# EAGLE design MCUDemoBoard (EAGLE 9.6.2)
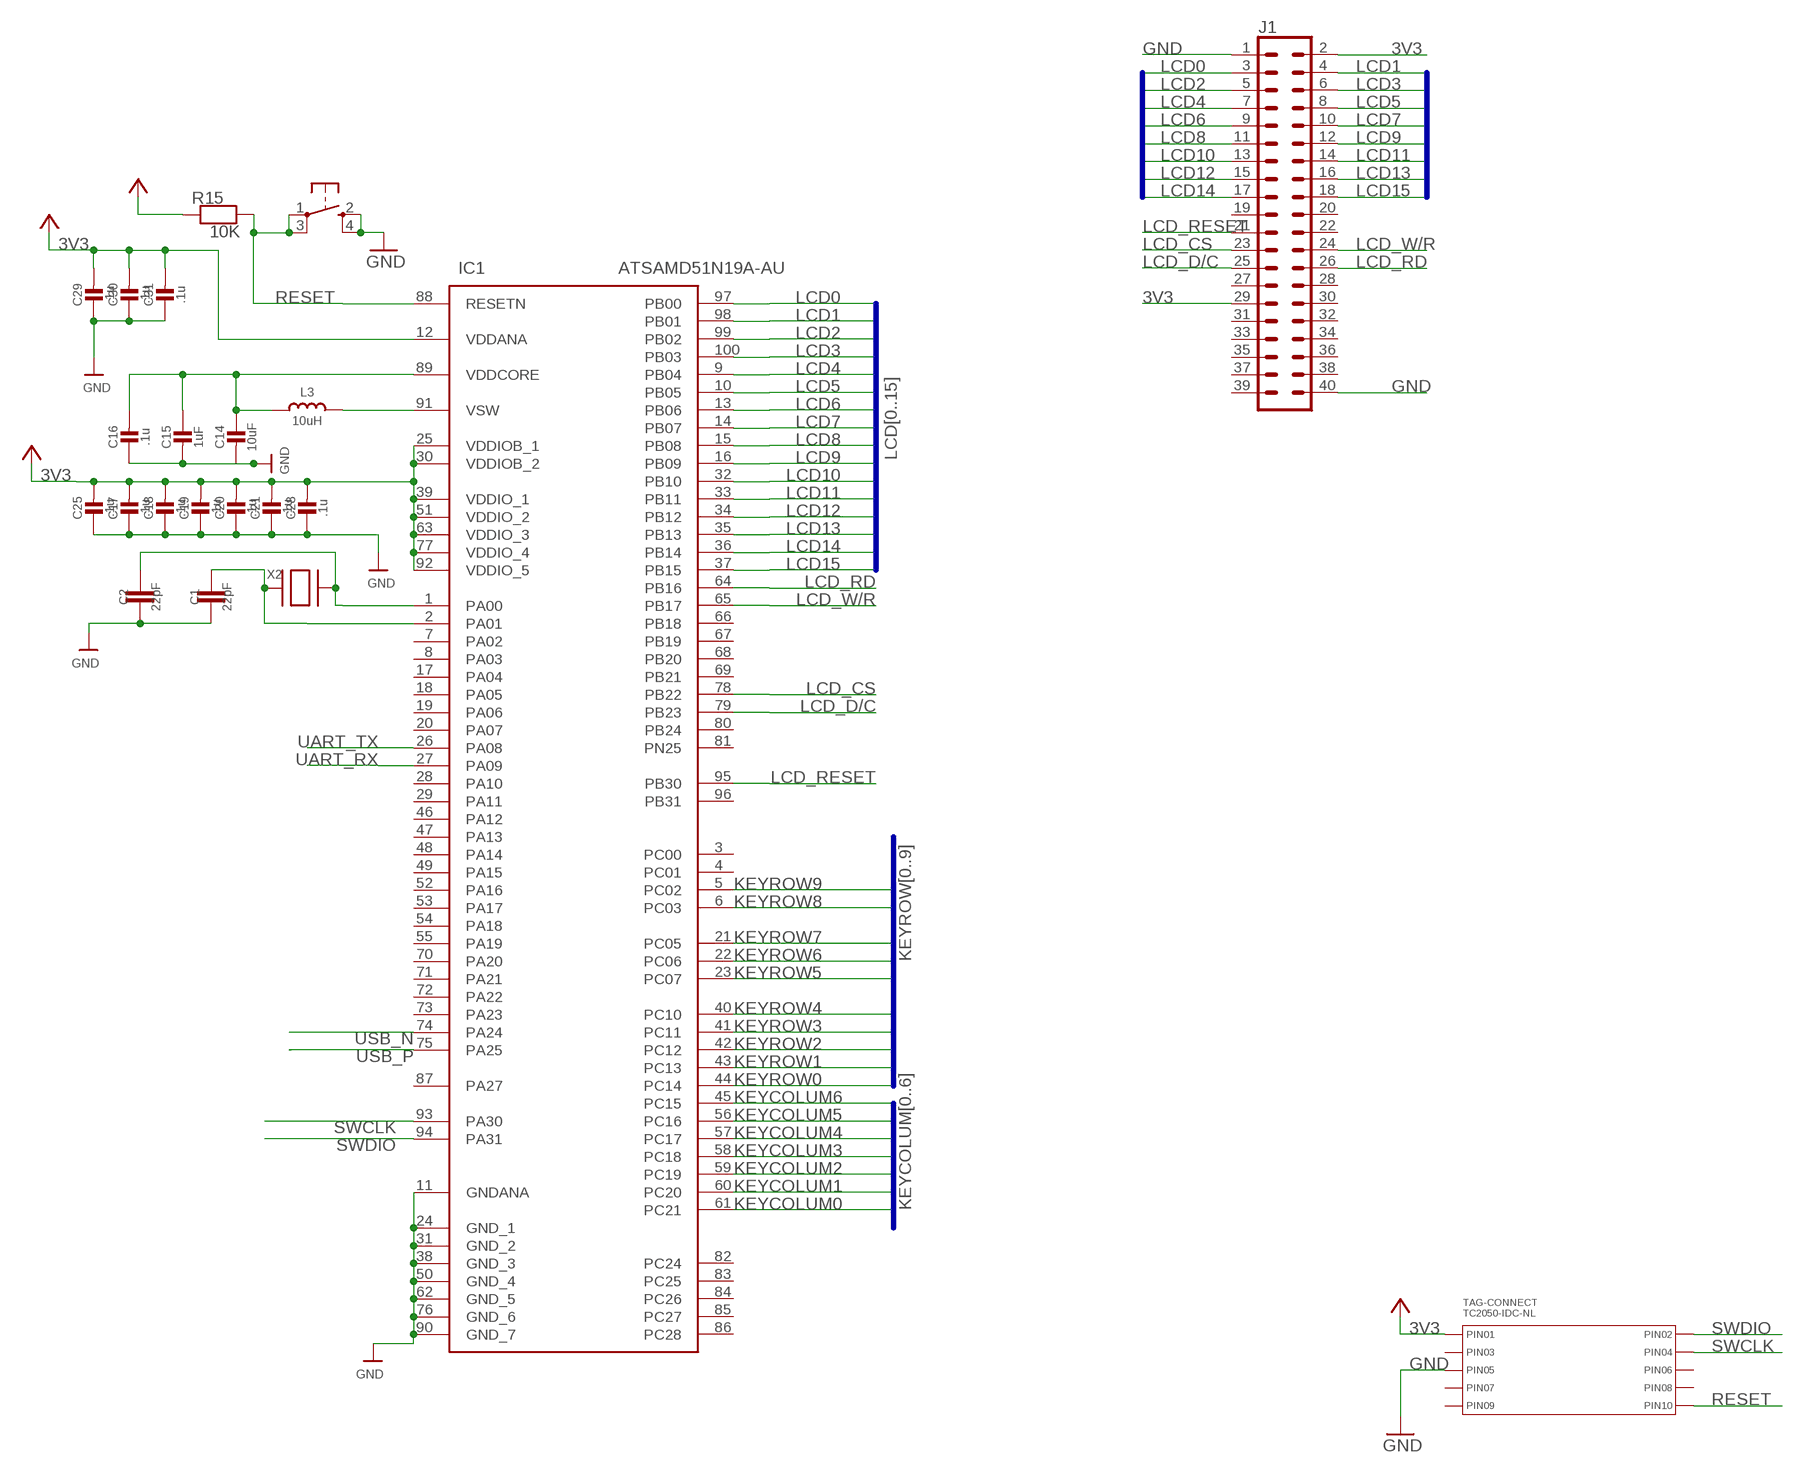
[diagram p0: schematic, sheet 1, part 1 of 2]
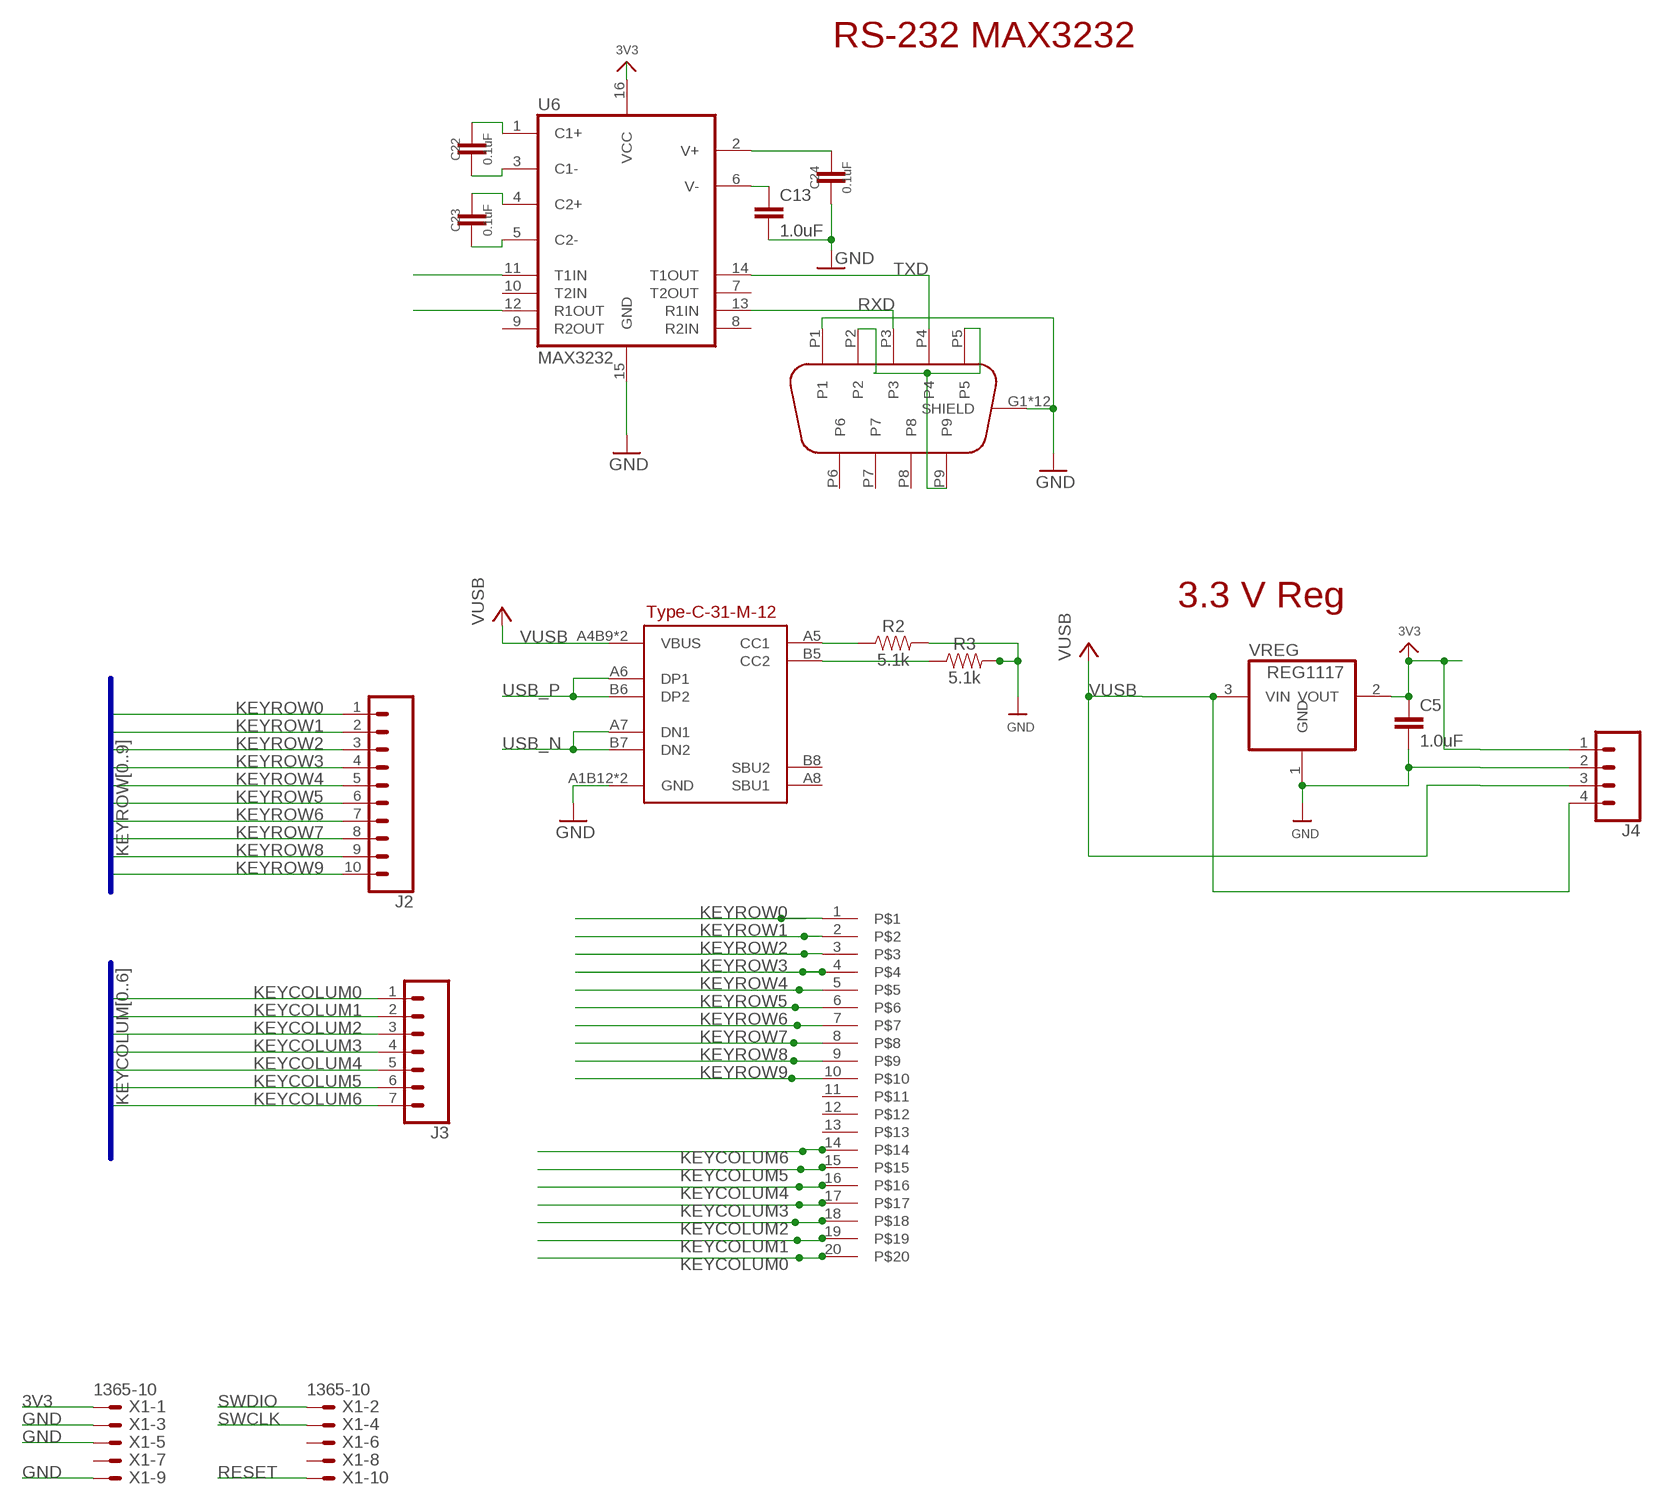
[diagram p1: schematic, sheet 1, part 2 of 2]

## Parts
C1  22pF  1.0UF-0805-25V-10%  [0805]
C2  22pF  1.0UF-0805-25V-10%  [0805]
C5  1.0uF  1.0UF-0805-25V-10%  [0805]
C13  1.0uF  1.0UF-0805-25V-10%  [0805]
C14  10uF  CAP_CERAMIC0805-NOOUTLINE  [0805-NO]
C15  1uF  CAP_CERAMIC0603_NO  [0603-NO]
C16  .1u  CAP_CERAMIC0603_NO  [0603-NO]
C17  .1u  CAP_CERAMIC0603_NO  [0603-NO]
C18  .1u  CAP_CERAMIC0603_NO  [0603-NO]
C19  .1u  CAP_CERAMIC0603_NO  [0603-NO]
C20  .1u  CAP_CERAMIC0603_NO  [0603-NO]
C21  .1u  CAP_CERAMIC0603_NO  [0603-NO]
C22  0.1uF  1.0UF-0805-25V-10%  [0805]
C23  0.1uF  1.0UF-0805-25V-10%  [0805]
C24  0.1uF  1.0UF-0805-25V-10%  [0805]
C25  .1u  CAP_CERAMIC0603_NO  [0603-NO]
C28  .1u  CAP_CERAMIC0603_NO  [0603-NO]
C29  .1u  CAP_CERAMIC0603_NO  [0603-NO]
C30  .1u  CAP_CERAMIC0603_NO  [0603-NO]
C31  .1u  CAP_CERAMIC0603_NO  [0603-NO]
DE9FEMALE  EDGEMOUNTDE9  [DE09S065TLF]
IC1  ATSAMD51N19A-AU  [QFP50P1600X1600X120-100N]
J1  CONN_20X2NOSILK  [2X20_NOSILK]
J2  CONN_10NO_SILK_PTH_FEMALE  [1X10_NO_SILK]
J3  CONN_07NO_SILK  [1X07_NO_SILK]
J4  CONN_04  [1X04]
L3  10uH  INDUCTOR  [INDUCTOR_1007]
R2  5.1k  1KOHM-0603-1/10W-1%  [0603]
R3  5.1k  1KOHM-0603-1/10W-1%  [0603]
R15  10K  RESISTOR_0603_NOOUT  [0603-NO]
SW2  SPST_TACT-KMR2  [KMR2]
TAG-CONNECT  TC2050-IDC-NL  CON_02X05_TC2050-IDC-NL  [TC2050-IDC-NL]
U6  MAX3232  MAX2323SOIC16  [SO16]
U$1  FC1-20-L2-T-WT20PIN  [FC1-20-L2-T-WT]
USB  TYPE-C-31-M-12  [TYPE-C-31-M-12]
VREG  REG1117  [SOT223]
X1  1365-10  [1365-10]
X2  NX3215SA-32.768K-STD-MUA-8  XTAL-3.2X1.5  [XTAL3215]

## Nets
3V3: C5.1 C17.2 C18.2 C19.2 C20.2 C21.2 C25.2 C28.2 C29.2 C30.2 C31.2 IC1.12(VDDANA) IC1.25(VDDIOB_1) IC1.30(VDDIOB_2) IC1.39(VDDIO_1) IC1.51(VDDIO_2) IC1.63(VDDIO_3) IC1.77(VDDIO_4) IC1.92(VDDIO_5) J1.2 J1.29 J4.1 R15.1 TAG-CONNECT.P$1(PIN1) U6.16(VCC) VREG.2(VOUT) X1.1 ; supply symbol labelled +3V3
GND: C1.1 C2.1 C5.2 C13.2 C14.2 C15.2 C16.1 C17.1 C18.1 C19.1 C20.1 C21.1 C24.2 C25.1 C28.1 C29.1 C30.1 C31.1 DE9FEMALE.G1(SHIELD) DE9FEMALE.G2(SHIELD) DE9FEMALE.G3(SHIELD) DE9FEMALE.G4(SHIELD) DE9FEMALE.G5(SHIELD) DE9FEMALE.G6(SHIELD) DE9FEMALE.G7(SHIELD) DE9FEMALE.G8(SHIELD) DE9FEMALE.G9(SHIELD) DE9FEMALE.G10(SHIELD) DE9FEMALE.G11(SHIELD) DE9FEMALE.G12(SHIELD) DE9FEMALE.P1 IC1.11(GNDANA) IC1.24(GND_1) IC1.31(GND_2) IC1.38(GND_3) IC1.50(GND_4) IC1.62(GND_5) IC1.76(GND_6) IC1.90(GND_7) J1.1 J1.40 J4.2 R2.2 R3.2 SW2.2(S) SW2.4(S1) TAG-CONNECT.P$5(PIN5) U6.15(GND) USB.A1B12(GND) USB.B1A12(GND) VREG.1(GND) X1.3 X1.5 X1.9
KEYCOLUM0: IC1.61(PC21) J3.1 U$1.20
KEYCOLUM1: IC1.60(PC20) J3.2 U$1.19
KEYCOLUM2: IC1.59(PC19) J3.3 U$1.18
KEYCOLUM3: IC1.58(PC18) J3.4 U$1.17
KEYCOLUM4: IC1.57(PC17) J3.5 U$1.16
KEYCOLUM5: IC1.56(PC16) J3.6 U$1.15
KEYCOLUM6: IC1.45(PC15) J3.7 U$1.14
KEYROW0: IC1.44(PC14) J2.1 U$1.1
KEYROW1: IC1.43(PC13) J2.2 U$1.2
KEYROW2: IC1.42(PC12) J2.3 U$1.3
KEYROW3: IC1.41(PC11) J2.4 U$1.4
KEYROW4: IC1.40(PC10) J2.5 U$1.5
KEYROW5: IC1.23(PC07) J2.6 U$1.6
KEYROW6: IC1.22(PC06) J2.7 U$1.7
KEYROW7: IC1.21(PC05) J2.8 U$1.8
KEYROW8: IC1.6(PC03) J2.9 U$1.9
KEYROW9: IC1.5(PC02) J2.10 U$1.10
LCD0: IC1.97(PB00) J1.3
LCD1: IC1.98(PB01) J1.4
LCD2: IC1.99(PB02) J1.5
LCD3: IC1.100(PB03) J1.6
LCD4: IC1.9(PB04) J1.7
LCD5: IC1.10(PB05) J1.8
LCD6: IC1.13(PB06) J1.9
LCD7: IC1.14(PB07) J1.10
LCD8: IC1.15(PB08) J1.11
LCD9: IC1.16(PB09) J1.12
LCD10: IC1.32(PB10) J1.13
LCD11: IC1.33(PB11) J1.14
LCD12: IC1.34(PB12) J1.15
LCD13: IC1.35(PB13) J1.16
LCD14: IC1.36(PB14) J1.17
LCD15: IC1.37(PB15) J1.18
LCD_CS: IC1.78(PB22) J1.23
LCD_D/C: IC1.79(PB23) J1.25
LCD_RD: IC1.64(PB16) J1.26
LCD_RESET: IC1.95(PB30) J1.21
LCD_W/R: IC1.65(PB17) J1.24
N$1: C24.1 U6.2(V+)
N$4: C2.2 IC1.1(PA00) X2.P$1
N$5: C1.2 IC1.2(PA01) X2.P$2
N$6: C22.2 U6.3(C1-)
N$9: C22.1 U6.1(C1+)
N$12: C23.1 U6.4(C2+)
N$15: C23.2 U6.5(C2-)
N$21: C13.1 U6.6(V-)
N$22: DE9FEMALE.P2 DE9FEMALE.P5 DE9FEMALE.P9
N$24: R2.1 USB.A5(CC1)
N$25: R3.1 USB.B5(CC2)
N$26: C14.1 C15.1 C16.2 IC1.89(VDDCORE) L3.P$1
N$27: IC1.91(VSW) L3.P$2
RESET: IC1.88(RESETN) R15.2 SW2.1(P) SW2.3(P1) TAG-CONNECT.P$10(PIN10) X1.10
RXD: DE9FEMALE.P3 U6.13(R1IN)
SWCLK: IC1.93(PA30) TAG-CONNECT.P$4(PIN4) X1.4
SWDIO: IC1.94(PA31) TAG-CONNECT.P$2(PIN2) X1.2
TXD: DE9FEMALE.P4 U6.14(T1OUT)
UART_RX: IC1.27(PA09) U6.12(R1OUT)
UART_TX: IC1.26(PA08) U6.11(T1IN)
USB_N: IC1.74(PA24) USB.A7(DN1) USB.B7(DN2)
USB_P: IC1.75(PA25) USB.A6(DP1) USB.B6(DP2)
VUSB: J4.3 J4.4 USB.A4B9(VBUS) USB.B4A9(VBUS) VREG.3(VIN)
Unconnected: DE9FEMALE.P6 DE9FEMALE.P7 DE9FEMALE.P8 IC1.3(PC00) IC1.4(PC01) IC1.7(PA02) IC1.8(PA03) IC1.17(PA04) IC1.18(PA05) IC1.19(PA06) IC1.20(PA07) IC1.28(PA10) IC1.29(PA11) IC1.46(PA12) IC1.47(PA13) IC1.48(PA14) IC1.49(PA15) IC1.52(PA16) IC1.53(PA17) IC1.54(PA18) IC1.55(PA19) IC1.66(PB18) IC1.67(PB19) IC1.68(PB20) IC1.69(PB21) IC1.70(PA20) IC1.71(PA21) IC1.72(PA22) IC1.73(PA23) IC1.80(PB24) IC1.81(PN25) IC1.82(PC24) IC1.83(PC25) IC1.84(PC26) IC1.85(PC27) IC1.86(PC28) IC1.87(PA27) IC1.96(PB31) J1.19 J1.20 J1.22 J1.27 J1.28 J1.30 J1.31 J1.32 J1.33 J1.34 J1.35 J1.36 J1.37 J1.38 J1.39 TAG-CONNECT.P$3(PIN3) TAG-CONNECT.P$6(PIN6) TAG-CONNECT.P$7(PIN7) TAG-CONNECT.P$8(PIN8) TAG-CONNECT.P$9(PIN9) U6.7(T2OUT) U6.8(R2IN) U6.9(R2OUT) U6.10(T2IN) U$1.11 U$1.12 U$1.13 USB.A8(SBU1) USB.B8(SBU2) X1.6 X1.7 X1.8

## Buses
LCD[0..15]
KEYCOLUM[0..6]
KEYROW[0..9]

## Notes on the sheet
- RS-232 MAX3232
- 3.3 V Reg
- Type-C-31-M-12

## Library data of the parts
C1 C2 C22-C24 = SparkFun-Capacitors:1.0UF: 1µF ceramic capacitors A capacitor is a passive two-terminal electrical component used to store electrical energy temporarily in an electric field.; PROD_ID: CAP-08064; VALUE: 1.0uF
C5 C13 = SparkFun-Capacitors:1.0UF: 1µF ceramic capacitors A capacitor is a passive two-terminal electrical component used to store electrical energy temporarily in an electric field.; PROD_ID: CAP-08064
C14-C21 C25 C28-C31 = microbuilder:CAP_CERAMIC: Ceramic Capacitors For new designs, use the packages preceded by an '_' character since they are more reliable: The following footprints should be used on most boards: _0402 - Standard footprint for regular board layouts _0603 - Standard footprint for regular board layouts _0805 - Standard footprint for regular board layouts _1206 - Standard footprint for regular board layouts For extremely tight-pitch boards where space is at a premium, the following 'micro-pitch' footprints can be used (smaller pads, no silkscreen outline, etc.): _0402MP - Micro-pitch footprint for very dense/compact boards _0603MP - Micro-pitch footprint for very dense/compact boards _0805MP - Micro-pitch footprint for very dense/compact boards _1206MP - Micro-pitch footprint for very dense/compact boards
DE9FEMALE = Serial:EDGEMOUNTDE9
IC1 = SamacSys_Parts:ATSAMD51N19A-AU: ARM Microcontrollers - MCU 120MHZ 512KB FLASH 1 00 TQFP PKG 85C Source: Datasheet <http://www.microchip.com/mymicrochip/filehandler.aspx?ddocname=en599585>; DESCRIPTION: ARM Microcontrollers - MCU 120MHZ 512KB FLASH 1 00 TQFP PKG 85C; HEIGHT: 1.2mm; MANUFACTURER_NAME: Microchip; MANUFACTURER_PART_NUMBER: ATSAMD51N19A-AU; MOUSER_PART_NUMBER: 556-ATSAMD51N19AAU; MOUSER_PRICE-STOCK: https://www.mouser.co.uk/ProductDetail/Microchip-Technology-Atmel/ATSAMD51N19A-AU?qs=HXFqYaX1Q2xcdk4pqJrDrA%3D%3D
J1 = SparkFun-Connectors:CONN_20X2: Multi connection point. Often used as Generic Header-pin footprint for 0.1 inch spaced/style header connections On any of the 0.1 inch spaced packages, you can populate with these: Break Away Headers - Straight <https://www.sparkfun.com/products/116> (PRT-00116) Break Away Male Headers - Right Angle <https://www.sparkfun.com/products/553> (PRT-00553) Female Headers <https://www.sparkfun.com/products/115> (PRT-00115) Break Away Headers - Machine Pin <https://www.sparkfun.com/products/117> (PRT-00117) Break Away Female Headers - Swiss Machine Pin <https://www.sparkfun.com/products/743> (PRT-00743)
J2 = SparkFun-Connectors:CONN_10: Multi connection point. Often used as Generic Header-pin footprint for 0.1 inch spaced/style header connections On any of the 0.1 inch spaced packages, you can populate with these: Break Away Headers - Straight <https://www.sparkfun.com/products/116> (PRT-00116) Break Away Male Headers - Right Angle <https://www.sparkfun.com/products/553> (PRT-00553) Female Headers <https://www.sparkfun.com/products/115> (PRT-00115) Break Away Headers - Machine Pin <https://www.sparkfun.com/products/117> (PRT-00117) Break Away Female Headers - Swiss Machine Pin <https://www.sparkfun.com/products/743> (PRT-00743) Arduino Stackable Header - 10 Pin <https://www.sparkfun.com/products/11376> (PRT-11376) For SCREWTERMINALS and SPRING TERMINALS visit here: Screw Terimnals on SparkFun.com <https://www.sparkfun.com/search/results?term=Screw+Terminals> (5mm/3.5mm/2.54mm spacing) This device is also useful as a general connection point to wire up your design to another part of your project. Our various solder wires solder well into these plated through hole pads. Hook-Up Wire - Assortment (Stranded, 22 AWG) <https://www.sparkfun.com/products/11375> (PRT-11375) Hook-Up Wire - Assortment (Solid Core, 22 AWG) <https://www.sparkfun.com/products/11367> (PRT-11367) View the entire wire category on our website here <https://www.sparkfun.com/categories/141> Special notes: Molex polarized connector foot print use with SKU : PRT-08231 with associated crimp pins and housings. 1MM SMD Version SKU: PRT-10208 NOTES ON THE VARIANTS LOCK and LOCK_LONGPADS... This footprint was designed to help hold the alignment of a through-hole component (i.e. 6-pin header) while soldering it into place. You may notice that each hole has been shifted either up or down by 0.005 of an inch from it's more standard position (which is a perfectly straight line). This slight alteration caused the pins (the squares in the middle) to touch the edges of the holes. Because they are alternating, it causes a "brace" to hold the component in place. 0.005 has proven to be the perfect amount of "off-center" position when using our standard breakaway headers. Although looks a little odd when you look at the bare footprint, once you have a header in there, the alteration is very hard to notice. Also,if you push a header all the way into place, it is covered up entirely on the bottom side.; PROD_ID: CONN-11563
J3 = SparkFun-Connectors:CONN_07: Multi connection point. Often used as Generic Header-pin footprint for 0.1 inch spaced/style header connections On any of the 0.1 inch spaced packages, you can populate with these: Break Away Headers - Straight <https://www.sparkfun.com/products/116> (PRT-00116) Break Away Male Headers - Right Angle <https://www.sparkfun.com/products/553> (PRT-00553) Female Headers <https://www.sparkfun.com/products/115> (PRT-00115) Break Away Headers - Machine Pin <https://www.sparkfun.com/products/117> (PRT-00117) Break Away Female Headers - Swiss Machine Pin <https://www.sparkfun.com/products/743> (PRT-00743) For SCREWTERMINALS and SPRING TERMINALS visit here: Screw Terimnals on SparkFun.com <https://www.sparkfun.com/search/results?term=Screw+Terminals> (5mm/3.5mm/2.54mm spacing) This device is also useful as a general connection point to wire up your design to another part of your project. Our various solder wires solder well into these plated through hole pads. Hook-Up Wire - Assortment (Stranded, 22 AWG) <https://www.sparkfun.com/products/11375> (PRT-11375) Hook-Up Wire - Assortment (Solid Core, 22 AWG) <https://www.sparkfun.com/products/11367> (PRT-11367) View the entire wire category on our website here <https://www.sparkfun.com/categories/141> Special notes: Molex polarized connector foot print use with SKU : PRT-08231 with associated crimp pins and housings. 1MM SMD Version SKU: PRT-10208 NOTES ON THE VARIANTS LOCK and LOCK_LONGPADS... This footprint was designed to help hold the alignment of a through-hole component (i.e. 6-pin header) while soldering it into place. You may notice that each hole has been shifted either up or down by 0.005 of an inch from it's more standard position (which is a perfectly straight line). This slight alteration caused the pins (the squares in the middle) to touch the edges of the holes. Because they are alternating, it causes a "brace" to hold the component in place. 0.005 has proven to be the perfect amount of "off-center" position when using our standard breakaway headers. Although looks a little odd when you look at the bare footprint, once you have a header in there, the alteration is very hard to notice. Also,if you push a header all the way into place, it is covered up entirely on the bottom side.
J4 = SparkFun-Connectors:CONN_04: Multi connection point. Often used as Generic Header-pin footprint for 0.1 inch spaced/style header connections On any of the 0.1 inch spaced packages, you can populate with these: Break Away Headers - Straight <https://www.sparkfun.com/products/116> (PRT-00116) Break Away Male Headers - Right Angle <https://www.sparkfun.com/products/553> (PRT-00553) Female Headers <https://www.sparkfun.com/products/115> (PRT-00115) Break Away Headers - Machine Pin <https://www.sparkfun.com/products/117> (PRT-00117) Break Away Female Headers - Swiss Machine Pin <https://www.sparkfun.com/products/743> (PRT-00743) For SCREWTERMINALS and SPRING TERMINALS visit here: Screw Terimnals on SparkFun.com <https://www.sparkfun.com/search/results?term=Screw+Terminals> (5mm/3.5mm/2.54mm spacing) This device is also useful as a general connection point to wire up your design to another part of your project. Our various solder wires solder well into these plated through hole pads. Hook-Up Wire - Assortment (Stranded, 22 AWG) <https://www.sparkfun.com/products/11375> (PRT-11375) Hook-Up Wire - Assortment (Solid Core, 22 AWG) <https://www.sparkfun.com/products/11367> (PRT-11367) View the entire wire category on our website here <https://www.sparkfun.com/categories/141> Special notes: Molex polarized connector foot print use with SKU : PRT-08231 with associated crimp pins and housings. 1MM SMD Version SKU: PRT-10208; PROD_ID: CONN-09696
L3 = microbuilder:INDUCTOR: Inductors 0603: 10nH Ceramic Inductor - microwire antenna/RF (Digikey: 712-1434-2-ND) 0805: 560nH Ceramic Inductor - RF (Digikey: 553-1047-1-ND) 270nH Ceramic Inductor - Q = 40@250MHz, +-5%, 1 Ohm DC Resistance (Digikey: 535-10506-2-ND) 1007 (2518 Metric) SMT: 10µH 10% 250mOhm 820mA 1007 Inductor (Digikey: 587-2189-1-ND) 22µH 10% 500mOhm 580mA 1007 Inductor (Digikey: 587-2190-1-ND) 47µH 10% 950mOhm 420mA 1007 Inductor (Digikey: 587-2191-1-ND) 47µH 5% 100mOhm 1A 1008 Inductor (Digikey: 732-1816-1-ND) 5.0x5.0mm (Taiyo Yuden NR5040 Series) 6.8µH 20% 2.3A 64mOhm Inductor (Digikey: 587-2374-2-ND) 5.0x5.0mm (TDK VLC5045 Series) 4.7µH 20% 3.3A 34mOhm Inductor (Digikey: 445-6526-1-ND) 6.8µH 20% 2.7A 46mOhm Inductor (Digikey: 445-6527-1-ND) 6.0x6.0mm (TDK VLC6045 Series) 4.7µH 20% 3.8A 27mOhm Inductor (Digikey: 445-6538-2-ND) 6.8µH 20% 3A 41mOhm Inductor (Digikey: 445-6540-1-ND) 6.2µH 30% 2.2A 45mOhm Inductor (Digikey: SRR5028-6R2YCT-ND) - Not TDK VLC6045 but footprint should match 6.0x6.0mm (TDK SLF6045 Series) 6.8uH 30% 2A 33mOhm Inductor (Digikey: 445-4572-1-ND, Mouser: 810-SLF645T6R8N2R0PF) 6.0x6.0mm (Sumida CDRH5D28 Series) 6.2uH 30% 1.8A 45mOhm Inductor (Digikey: 308-1542-1-ND) Taiyo Yuden NR3015T2R2M - 2.2uH 20% 1.5A (Digikey: 587-1648-2-ND, Mouser: 963-NR3015T2R2M) - Used with TI TPS62172 CoilCraft RFID Transponder Coil - MA5532-AE (For use with AS3935 Lightning Sensor) Taiyo Yuden NRH2412T2R2MNGH - 2.2uH 20% 1AA (Digikey: 587-3443-1-ND) - Used with TI LM3671 Vishay IHLP 1.0uH Molded Inductor - 24mOhm DCR, 5A, +/-20%, -55°C-125°C (Digikey: 541-1319-1-ND)
R2 R3 = SparkFun-Resistors:1KOHM: 1kΩ resistor A resistor is a passive two-terminal electrical component that implements electrical resistance as a circuit element. Resistors act to reduce current flow, and, at the same time, act to lower voltage levels within circuits. - Wikipedia; PROD_ID: RES-07856; VALUE: 1k
R15 = microbuilder:RESISTOR: Resistors For new designs, use the packages preceded by an '_' character since they are more reliable: The following footprints should be used on most boards: _0402 - Standard footprint for regular board layouts _0603 - Standard footprint for regular board layouts _0805 - Standard footprint for regular board layouts _1206 - Standard footprint for regular board layouts For extremely tight-pitch boards where space is at a premium, the following 'micro-pitch' footprints can be used (smaller pads, no silkscreen outline, etc.): _0402MP - Micro-pitch footprint for very dense/compact boards _0603MP - Micro-pitch footprint for very dense/compact boards _0805MP - Micro-pitch footprint for very dense/compact boards _1206MP - Micro-pitch footprint for very dense/compact boards
SW2 = adafruit:SPST_TACT: SMT 6mm switch, EVQQ2 series http://www.ladyada.net/library/eagle
TAG-CONNECT = MF_Connectors:CON_02X05: Library: MF_Connectors Description: Header Connector with 10 Positions and 02 Rows. Use the LABEL Attribute to label the pin on the schematic and PCB. You can remove the attributes on the PCB by using the SMASH function on the part and then deleting the text.; HOUSEPART: NO; MPN: TC2050-IDC-NL; POPULATE: 0; URL: http://www.tag-connect.com/Materials/TC2050-IDC-NL%20Datasheet.pdf
U6 = SparkFun-IC-Comms:MAX2323: RS232 Transceiver This part covers 232 drivers that are compatible with the MAX3232. Sipex SP3232EB Datasheet <http://cdn.sparkfun.com/datasheets/Components/General%20IC/SP3232EBCA-L.pdf> SparkFun Products SOIC component <https://www.sparkfun.com/products/589> (COM-00589 / IC-08171) Retired DIP component (COM-00316 / IC-08446) SparkFun Transceiver Breakout - MAX3232 <https://www.sparkfun.com/products/11189> (BOB-11189) SparkFun XBee Explorer Serial <https://www.sparkfun.com/products/13225> (WRL-13225); PROD_ID: IC-08171
U$1 = FPC:FC1-20-L2-T-WT20PIN
USB = USBC:TYPE-C-31-M-12
VREG = burr-brown:REG1117: 800mA and 1A Low Dropout (LDO) Positive Regulator 1.8V, 2.5V, 2.85V, 3.3V, 5V, and Adj; MPN: REG1117; OC_FARNELL: 1097566; OC_NEWARK: 14P6981
X1 = con-leotronics:1365-10: DUAL ROW STRAIGHT HEADER 1364 SERIES. 1.27mm x 1.27mm. Without Fixing Post. SMT Source: http://www.leotronics.co.uk/Conexcon/Data%20Sheets/sec.%20A/1364ing.pdf; OC_FARNELL: unknown; OC_NEWARK: unknown
X2 = adafruit2:XTAL: Low cost SMT crystals, no capacitors included http://www.ladyada.net/library/eagle

## Board
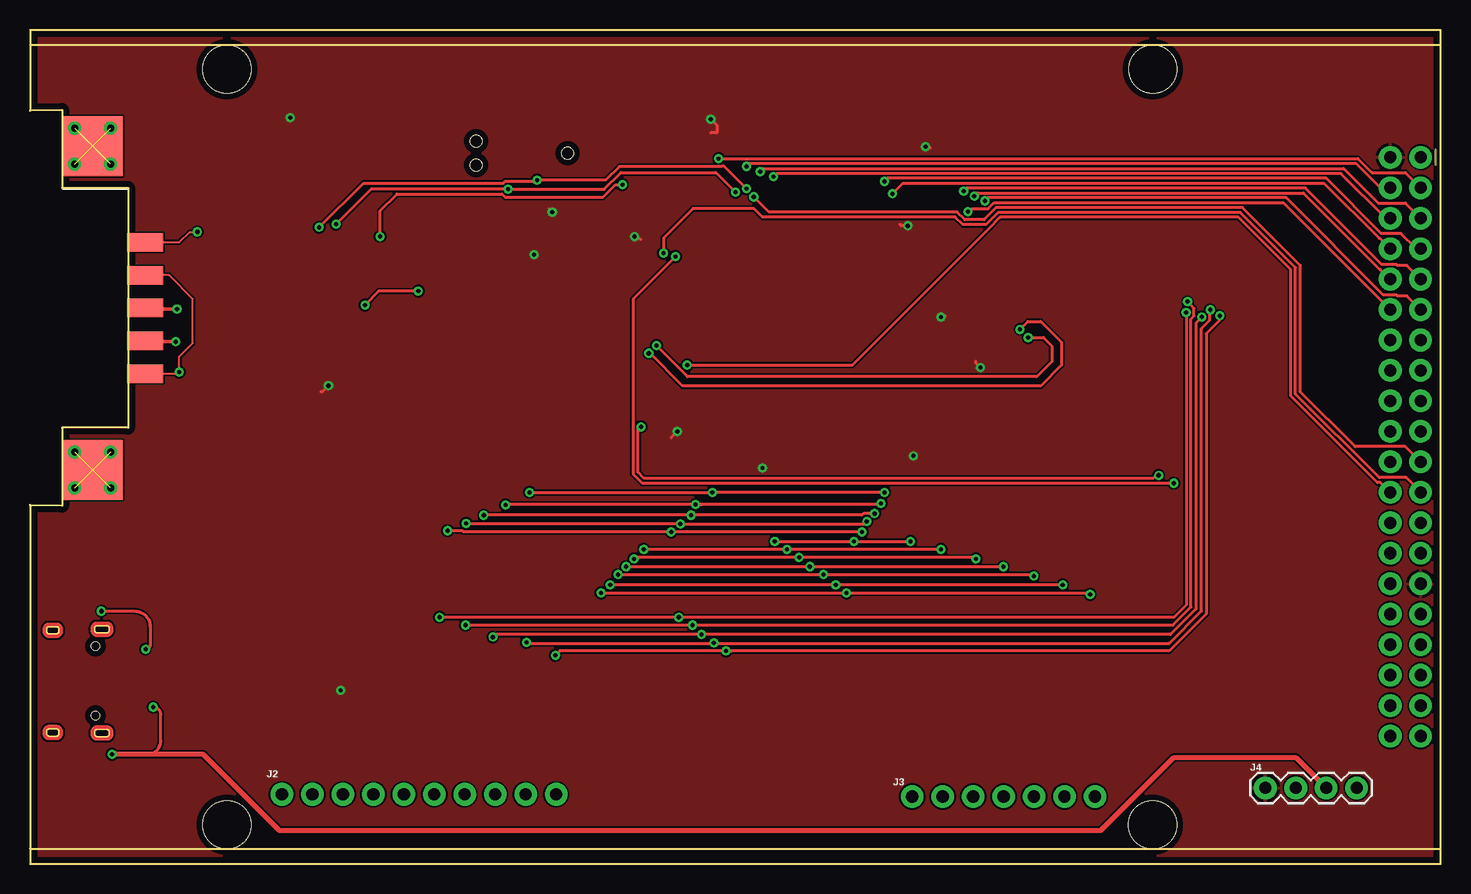
[diagram p2: board, top side]
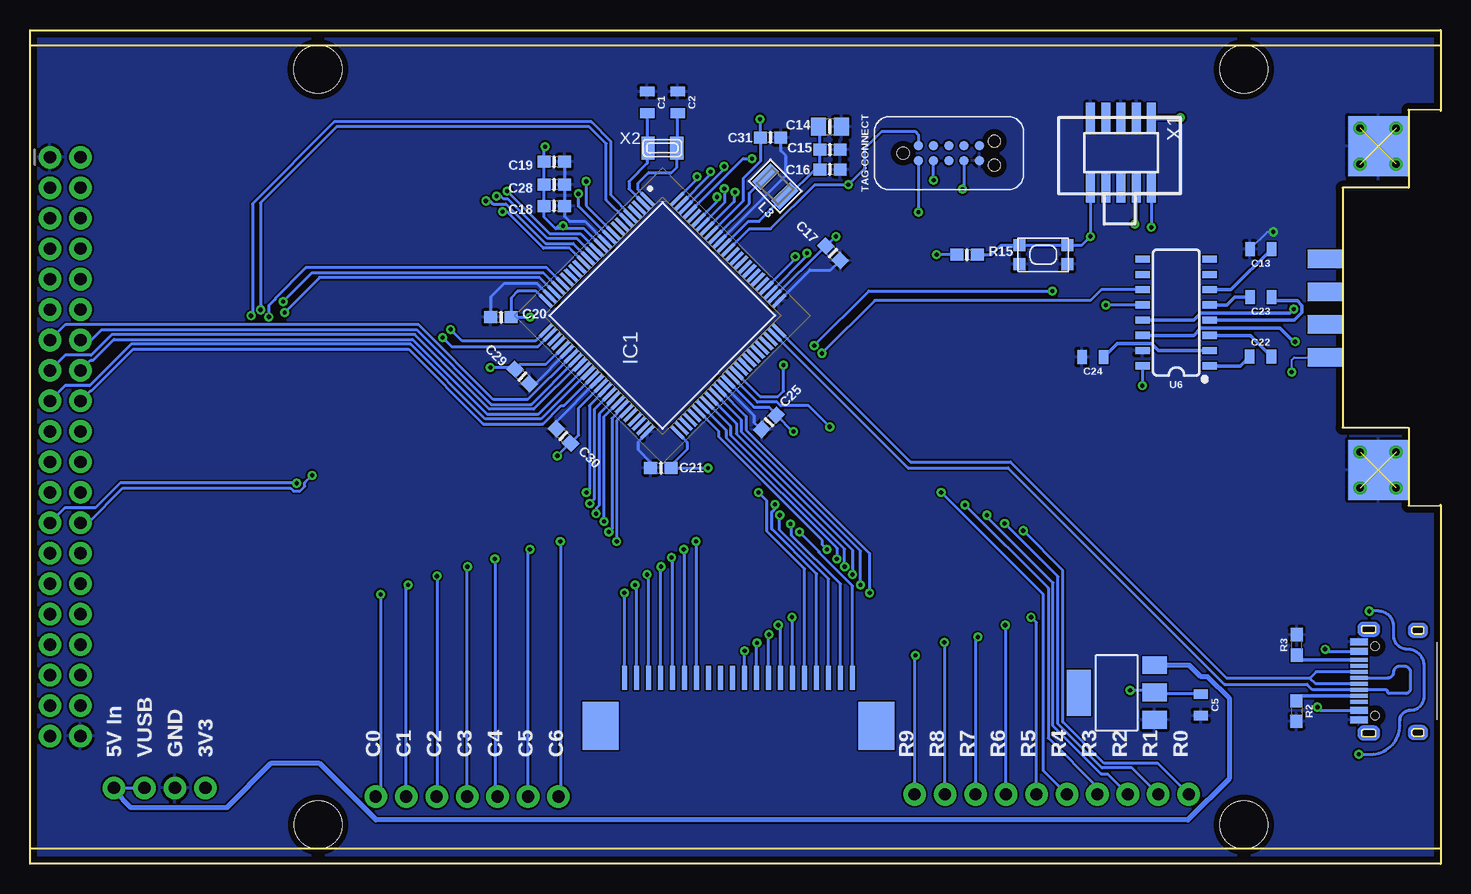
[diagram p3: board, bottom side, seen from below]

Size 117.6 x 69.54 mm. Coordinates in mm from the lower left corner, seen from the top.
Outline: 0,62.85 2.68,62.89 2.68,56.39 8.18,56.39 8.18,36.39 2.68,36.39 2.68,29.89 0,29.87
Outline: 0,62.85 0,69.54 117.6,69.54 117.6,0 0,0 0,29.87
Outline: 0,62.85 0,62.78
Outline: 0,29.95 0,29.87
Copper layers (1*16): Top 0.035mm / dielectric 1.5mm / Bottom 0.035mm
Design rules "default *": minimum track width 6mil, minimum drill 0.35mm, track to track 6mil, track to pad 6mil, pad to pad 6mil, via to via 6mil, smd to smd 6mil, copper to edge 20mil, drill to drill 6mil, minimum pad ring 10mil, minimum via ring 8mil, stop-mask expansion 4mil, vias tented up to drill 0mil, thermal gap 10mil
Holes 4 mm at 16.42,66.27 93.61,66.27 93.58,3.28 16.42,3.28
Milling: 12 lines

### Footprints (pad centres in the part's own frame; a part is rotated, then mirrored left to right if it is on the bottom)
0805 = smd 0.8 x 1.2: 1 -0.9,0; 2 0.9,0
0805-NO = smd 1.24 x 1.5: 1 -0.95,0; 2 0.95,0
0603-NO = smd 1.075 x 1: 1 -0.85,0; 2 0.85,0
DE09S065TLF = drill 0.6: G1 -15,4.5; G2 -12,4.5; G3 -15,1.5; G4 -12,1.5; G5 12,4.5; G6 15,4.5; G7 12,1.5; G8 15,1.5 | smd 5 x 5 bottom: G9 13.5,3; G10 -13.5,3 | smd 5 x 5: G11 -13.5,3; G12 13.5,3 | smd 1.54 x 3: P1 5.48,-1.37; P2 2.74,-1.37; P3 0,-1.37; P4 -2.74,-1.37; P5 -5.48,-1.37 | smd 1.54 x 3 bottom: P6 4.11,-1.37; P7 1.37,-1.37; P8 -1.37,-1.37; P9 -4.11,-1.37
QFP50P1600X1600X120-100N = smd 1.475 x 0.3: 1 -7.738,6; 2 -7.738,5.5; 3 -7.738,5; 4 -7.738,4.5; 5 -7.738,4; 6 -7.738,3.5; 7 -7.738,3; 8 -7.738,2.5; 9 -7.738,2; 10 -7.738,1.5; 11 -7.738,1; 12 -7.738,0.5; 13 -7.738,0; 14 -7.738,-0.5; 15 -7.738,-1; 16 -7.738,-1.5; 17 -7.738,-2; 18 -7.738,-2.5; 19 -7.738,-3; 20 -7.738,-3.5; 21 -7.738,-4; 22 -7.738,-4.5; 23 -7.738,-5; 24 -7.738,-5.5; 25 -7.738,-6; 51 7.738,-6; 52 7.738,-5.5; 53 7.738,-5; 54 7.738,-4.5; 55 7.738,-4; 56 7.738,-3.5; 57 7.738,-3; 58 7.738,-2.5; 59 7.738,-2; 60 7.738,-1.5; 61 7.738,-1; 62 7.738,-0.5; 63 7.738,0; 64 7.738,0.5; 65 7.738,1; 66 7.738,1.5; 67 7.738,2; 68 7.738,2.5; 69 7.738,3; 70 7.738,3.5; 71 7.738,4; 72 7.738,4.5; 73 7.738,5; 74 7.738,5.5; 75 7.738,6 | smd 0.3 x 1.475: 26 -6,-7.738; 27 -5.5,-7.738; 28 -5,-7.738; 29 -4.5,-7.738; 30 -4,-7.738; 31 -3.5,-7.738; 32 -3,-7.738; 33 -2.5,-7.738; 34 -2,-7.738; 35 -1.5,-7.738; 36 -1,-7.738; 37 -0.5,-7.738; 38 0,-7.738; 39 0.5,-7.738; 40 1,-7.738; 41 1.5,-7.738; 42 2,-7.738; 43 2.5,-7.738; 44 3,-7.738; 45 3.5,-7.738; 46 4,-7.738; 47 4.5,-7.738; 48 5,-7.738; 49 5.5,-7.738; 50 6,-7.738; 76 6,7.738; 77 5.5,7.738; 78 5,7.738; 79 4.5,7.738; 80 4,7.738; 81 3.5,7.738; 82 3,7.738; 83 2.5,7.738; 84 2,7.738; 85 1.5,7.738; 86 1,7.738; 87 0.5,7.738; 88 0,7.738; 89 -0.5,7.738; 90 -1,7.738; 91 -1.5,7.738; 92 -2,7.738; 93 -2.5,7.738; 94 -3,7.738; 95 -3.5,7.738; 96 -4,7.738; 97 -4.5,7.738; 98 -5,7.738; 99 -5.5,7.738; 100 -6,7.738
2X20_NOSILK = drill 1.016 pad 1.88: 1 0,0; 2 0,2.54; 3 2.54,0; 4 2.54,2.54; 5 5.08,0; 6 5.08,2.54; 7 7.62,0; 8 7.62,2.54; 9 10.16,0; 10 10.16,2.54; 11 12.7,0; 12 12.7,2.54; 13 15.24,0; 14 15.24,2.54; 15 17.78,0; 16 17.78,2.54; 17 20.32,0; 18 20.32,2.54; 19 22.86,0; 20 22.86,2.54; 21 25.4,0; 22 25.4,2.54; 23 27.94,0; 24 27.94,2.54; 25 30.48,0; 26 30.48,2.54; 27 33.02,0; 28 33.02,2.54; 29 35.56,0; 30 35.56,2.54; 31 38.1,0; 32 38.1,2.54; 33 40.64,0; 34 40.64,2.54; 35 43.18,0; 36 43.18,2.54; 37 45.72,0; 38 45.72,2.54; 39 48.26,0; 40 48.26,2.54
1X10_NO_SILK = drill 1.016 pad 1.88: 1 0,0; 2 2.54,0; 3 5.08,0; 4 7.62,0; 5 10.16,0; 6 12.7,0; 7 15.24,0; 8 17.78,0; 9 20.32,0; 10 22.86,0
1X07_NO_SILK = drill 1.016 pad 1.88: 1 0,0; 2 2.54,0; 3 5.08,0; 4 7.62,0; 5 10.16,0; 6 12.7,0; 7 15.24,0
1X04 = drill 1.016 pad 1.88: 1 0,0; 2 2.54,0; 3 5.08,0; 4 7.62,0
INDUCTOR_1007 = smd 1.016 x 2.2: P$1 -1.127,0; P$2 1.127,0
0603 = smd 1.1 x 1: 1 -0.85,0; 2 0.85,0
KMR2 = smd 1 x 1: 1 2,0.8; 2 2,-0.8; 3 -2,0.8; 4 -2,-0.8
TC2050-IDC-NL = smd 0.787 x 0.787: P$1 -2.54,-0.635; P$2 -1.27,-0.635; P$3 0,-0.635; P$4 1.27,-0.635; P$5 2.54,-0.635; P$6 2.54,0.635; P$7 1.27,0.635; P$8 0,0.635; P$9 -1.27,0.635; P$10 -2.54,0.635 | hole 0.991: 3.81,1.016; 3.81,-1.016; -3.81,0
SO16 = smd 0.6 x 1.2: 1 -4.445,-2.8; 2 -3.175,-2.8; 3 -1.905,-2.8; 4 -0.635,-2.8; 5 0.635,-2.8; 6 1.905,-2.8; 7 3.175,-2.8; 8 4.445,-2.8; 9 4.445,2.8; 10 3.175,2.8; 11 1.905,2.8; 12 0.635,2.8; 13 -0.635,2.8; 14 -1.905,2.8; 15 -3.175,2.8; 16 -4.445,2.8
FC1-20-L2-T-WT = smd 0.4 x 2: 1 -9.5,1; 2 -8.5,1; 3 -7.5,1; 4 -6.5,1; 5 -5.5,1; 6 -4.5,1; 7 -3.5,1; 8 -2.5,1; 9 -1.5,1; 10 -0.5,1; 11 0.5,1; 12 1.5,1; 13 2.5,1; 14 3.5,1; 15 4.5,1; 16 5.5,1; 17 6.5,1; 18 7.5,1; 19 8.5,1; 20 9.5,1 | smd 3 x 4: P$1 -11.5,5; P$2 11.5,5
TYPE-C-31-M-12 = smd 0.6 x 1.45: A1B12 -3.25,0.8; A4B9 -2.45,0.8; B1A12 3.25,0.8; B4A9 2.45,0.8 | smd 0.3 x 1.45: A5 -1.25,0.8; A6 -0.25,0.8; A7 0.25,0.8; A8 1.25,0.8; B5 1.75,0.8; B6 0.75,0.8; B7 -0.75,0.8; B8 -1.75,0.8 | hole 0.7: -2.89,-0.53; 2.89,-0.53
SOT223 = smd 1.499 x 2.007: 1 -2.261,-3.15; 2 0.025,-3.15; 3 2.311,-3.15 | smd 3.81 x 2.007: 4 0,3.15
1365-10 = smd 0.76 x 2.4: 1 -2.54,-2.95; 2 -2.54,2.95; 3 -1.27,-2.95; 4 -1.27,2.95; 5 0,-2.95; 6 0,2.95; 7 1.27,-2.95; 8 1.27,2.95; 9 2.54,-2.95; 10 2.54,2.95
XTAL3215 = smd 1.1 x 1.9: P$1 1.2,0; P$2 -1.2,0

### Placement (x,y rotation side)
C1  66.15,63.5 270 bottom
C2  63.61,63.5 270 bottom
C5  20,13.27 270 bottom
C13  15,51.27 180 bottom
C14  50.91,61.47 0 bottom
C15  50.91,59.56 0 bottom
C16  50.91,57.91 180 bottom
C17  50.66,50.93 135 bottom
C18  73.9,54.86 180 bottom
C19  73.9,58.55 180 bottom
C20  78.34,45.59 0 bottom
C21  65.01,33.02 0 bottom
C22  15.02,42.31 0 bottom
C23  15,47.27 180 bottom
C24  29,42.27 180 bottom
C25  55.99,36.83 45 bottom
C28  73.9,56.64 180 bottom
C29  76.56,40.64 135 bottom
C30  73.14,35.69 315 bottom
C31  55.86,60.58 180 bottom
DE9FEMALE  8.22,46.35 90 top
IC1  64.88,45.72 315 bottom
J1  115.93,58.93 270 bottom
J2  21,5.81 0 top
J3  88.78,5.62 180 top
J4  102.98,6.35 0 top
L3  55.48,56.52 135 bottom
R2  12.03,12.75 270 bottom
R3  12,18.27 90 bottom
R15  39.48,50.8 0 bottom
SW2  33.13,50.8 0 bottom
TAG-CONNECT  41,59.27 0 bottom
U6  22.06,45.98 90 bottom
U$1  58.53,16.51 180 bottom
USB  6,15.27 90 bottom
VREG  27,14.27 90 bottom
X1  26.65,59.31 180 bottom
X2  64.88,59.69 0 bottom

### Tracks (layer width: path | path; a pad name or v marks a point on that pad's centre or on a via)
3V3  (via drill 0.35)
  Top 0.254: v75.93,45.59 76.06,45.72 76.31,45.72 | v73.17,53.21 72.63,53.21 72.5,53.34 | v56.75,62.1 57.26,61.6 57.26,60.96 56.75,60.96 | v50.4,52.32 50.66,52.32 50.91,52.07 | v43.54,54.36 43.29,54.61 | v24.88,39.88 24.37,39.37 24.24,39.37 | v53.96,36.07 53.45,35.56 | v73.64,34.04 73.64,34.16 73.77,34.29 | v79.23,41.4 78.85,41.78 78.85,41.91 | v74.66,59.82 74.91,59.82 75.04,59.69
  Bottom 0.254: C5.1 23.72,14.17 arc90 VREG.2 24.03,14.48 v25.89,14.48 | IC1.92 58.15,55.28 58.15,57.15 56.71,58.59 C31.2 56.71,62.1 v56.75,62.1 | IC1.12 71.41,52.96 73.77,52.96 | 73.77,52.96 74.75,53.94 C18.2 C28.2 C19.2 74.75,59.73 v74.66,59.82 | IC1.25 75.4,47.75 76.94,47.75 77.49,47.21 C20.2 v75.93,45.59 | IC1.30 74.6,41.66 76.75,41.66 C29.2 77.33,41.4 v79.23,41.4 | IC1.39 71.86,38.03 71.86,35.76 C30.2 72.59,35.09 v73.64,34.04 | IC1.51 63.65,35.98 62.85,35.18 62.85,34.54 64.16,33.23 C21.2 v61.07,33.02 | IC1.63 57.26,38.1 55.99,38.1 55.39,37.5 C25.2 54.03,36.07 v53.96,36.07 | IC1.77 51.29,51.53 C17.2 50.46,52.32 v50.4,52.32 | 73.77,52.96 73.52,53.21 v73.17,53.21 | TAG-CONNECT.P$1 v43.54,54.36 | R15.1 v42.02,50.8 | U6.16 24.86,39.9 v24.88,39.88
  Bottom 0.305: VREG.2 24.44,14.29
  Bottom 0.406: X1.1 24.08,62.23 v21.7,62.23
  pour Top: 117.58,69.47 -0.02,69.47 -0.02,0 117.58,0
GND  (via drill 0.35)  (10 unrouted)
  Top 0.152: DE9FEMALE.P1 12.45,51.83 13.32,52.71 v13.95,52.71
  Bottom 0.152: v13.95,52.71 14.46,52.71 C13.2
  Bottom 0.254: IC1.90 54.59,57.42 54.59,59.05 55.01,59.48 C31.1 | C19.1 C28.1 C18.1 73.05,54.01 72.63,53.59 71.34,53.59 IC1.11 | IC1.24 75.33,48.39 78.09,48.39 79.19,47.28 C20.1 | C29.1 75.51,40.04 IC1.31 | IC1.38 73.74,36.86 C30.1 | IC1.50 66.91,35.2 66.91,34.54 65.86,33.49 C21.1 | IC1.62 57.26,37.39 57.26,36.83 56.66,36.23 C25.1 | IC1.76 52.59,49.53 50.85,49.53 C17.1
  pour Bottom (rank 5): 117.58,0 117.58,69.6 -0.02,69.6 -0.02,0
KEYCOLUM0  (via drill 0.35)
  Top 0.254: v47.61,22.61 v68.05,22.61 88.25,22.61 v88.38,22.48
  Bottom 0.254: IC1.61 57.89,37.32 57.89,36.2 47.61,25.91 v47.61,22.61 | v88.38,22.48 88.38,6.03 J3.1 | U$1.20 68.03,22.58 v68.05,22.61
KEYCOLUM1  (via drill 0.35)
  Top 0.254: v86.09,23.26 v67.17,23.26 v48.37,23.26
  Bottom 0.254: J3.2 86.24,23.11 v86.09,23.26 | v48.37,23.26 48.37,26.09 58.3,36.03 58.3,37.02 IC1.60 | U$1.19 67.03,23.13 v67.17,23.26
KEYCOLUM2  (via drill 0.35)
  Top 0.254: v49.03,24.13 v66.15,24.13 83.55,24.13 v83.68,24
  Bottom 0.254: IC1.59 58.71,36.72 58.71,35.86 49.03,26.18 v49.03,24.13 | v83.68,24 83.68,5.64 J3.3 | U$1.18 66.03,24.01 v66.15,24.13
KEYCOLUM3  (via drill 0.35)
  Top 0.254: v81.14,24.79 v65.01,24.79 v49.69,24.79
  Bottom 0.254: J3.4 81.16,24.76 v81.14,24.79 | v49.69,24.79 49.69,26.26 59.16,35.74 59.16,36.47 IC1.58 | U$1.17 65.03,24.77 v65.01,24.79
KEYCOLUM4  (via drill 0.35)
  Top 0.254: v50.34,25.45 50.47,25.57 v64.12,25.57 78.72,25.57 v78.85,25.45
  Bottom 0.254: IC1.57 59.57,36.17 59.57,35.57 50.34,26.34 v50.34,25.45 | v78.85,25.45 78.85,5.85 J3.5 | U$1.16 64.03,25.48 v64.12,25.57
KEYCOLUM5  (via drill 0.35)
  Top 0.254: v75.93,26.23 v63.1,26.23 v51.16,26.23
  Bottom 0.254: J3.6 76.08,26.08 v75.93,26.23 | v51.16,26.23 51.55,26.61 51.55,26.97 60.18,35.61 60.18,36.07 IC1.56 | U$1.15 63.03,26.16 v63.1,26.23
KEYCOLUM6  (via drill 0.35)
  Top 0.254: v73.39,26.89 v68.69,26.89 v62.09,26.89
  Bottom 0.254: IC1.45 68.69,36.96 v68.69,26.89 | v73.39,26.89 73.39,5.77 J3.7 | U$1.14 62.03,26.83 v62.09,26.89
KEYROW0  (via drill 0.35)
  Top 0.254: v69.35,27.69 v53.45,27.69 53.39,27.75 36.08,27.75 36.03,27.79 v34.8,27.79
  Bottom 0.254: IC1.44 68.23,38.03 69.1,37.16 69.1,27.94 v69.35,27.69 | v53.45,27.69 51.82,26.06 51.82,25.96 49.03,23.17 U$1.1 | J2.1 23.6,8.41 28.07,8.41 31.5,11.84 31.5,24.49 v34.8,27.79
KEYROW1  (via drill 0.35)
  Top 0.254: v69.75,28.57 69.53,28.34 v54.21,28.34 54.15,28.41 v36.35,28.41
  Bottom 0.254: v54.21,28.34 54.11,28.24 54.11,27.41 50.03,23.34 U$1.2 | v69.75,28.57 69.75,37.31 IC1.43 | J2.2 25.73,8 28.24,8 31.91,11.67 31.91,23.97 v36.35,28.41
KEYROW2  (via drill 0.35)
  Top 0.254: v70.41,29.21 70.04,29.21 70.03,29.22 69.48,29.22 69.34,29.08 v55.1,29.08 v37.83,29.08
  Bottom 0.254: IC1.42 68.94,38.73 70.16,37.51 70.16,29.9 70.41,29.65 v70.41,29.21 | U$1.3 51.03,23.76 55.1,27.83 v55.1,29.08 | J2.3 27.76,7.49 28.3,7.49 32.32,11.51 32.32,23.44 37.83,28.96 v37.83,29.08
KEYROW3  (via drill 0.35)
  Top 0.254: v70.93,30.06 70.85,29.97 55.99,29.97 | v55.49,29.98 55.98,29.98 55.99,29.97 | 39.69,29.97 v39.65,29.93 39.69,29.97 | 55.99,29.97 39.69,29.97
  Bottom 0.254: IC1.41 70.57,37.91 70.57,30.42 v70.93,30.06 | U$1.4 52.03,24.19 55.76,27.91 55.76,29.36 55.49,29.62 v55.49,29.98 | v39.65,29.93 32.72,23 32.72,10.52 28.62,6.41 J2.4
KEYROW4  (via drill 0.35)
  Top 0.254: v71.22,30.99 v56.88,30.99 v41.64,30.99
  Bottom 0.254: IC1.40 70.97,38.21 70.97,31.24 v71.22,30.99 | U$1.5 53.03,24.61 56.16,27.75 56.16,30.27 v56.88,30.99 | J2.5 33.13,7.78 33.13,10.29 33.13,22.48 v41.64,30.99
KEYROW5  (via drill 0.35)
  Top 0.254: v96.38,45.97 96.38,21.59 95.36,20.57 v54.09,20.57 v34.15,20.57
  Bottom 0.254: IC1.23 75.13,48.9 93.45,48.9 v96.38,45.97 | U$1.6 54.03,20.52 v54.09,20.57 | J2.6 33.7,20.13 v34.15,20.57
KEYROW6  (via drill 0.35)
  Top 0.254: v36.3,19.92 v55.23,19.92 95.28,19.92 96.78,21.42 96.78,45.45 97.03,45.7 97.03,46.35 v96.5,46.88
  Bottom 0.254: J2.7 36.24,19.85 v36.3,19.92 | v96.5,46.88 94.08,49.3 74.83,49.3 IC1.22 | U$1.7 55.03,19.72 v55.23,19.92
KEYROW7  (via drill 0.35)
  Top 0.254: v97.69,45.62 97.19,45.11 97.19,21.25 95.06,19.13 v55.99,19.13 38.8,19.13 v38.59,18.92
  Bottom 0.254: IC1.21 74.53,49.71 94.61,49.71 97.16,47.16 97.16,47.09 97.69,46.56 v97.69,45.62 | v38.59,18.92 38.78,18.73 J2.8 | U$1.8 56.03,19.09 v55.99,19.13
KEYROW8  (via drill 0.35)
  Top 0.254: v41.38,18.47 41.44,18.41 57.13,18.41 | v98.39,46.21 98.35,46.17 98.35,45.34 97.65,44.64 97.65,21.08 94.98,18.41 57.13,18.41 | v57.01,18.44 57.03,18.41 57.13,18.41
  Bottom 0.254: J2.9 41.32,18.41 v41.38,18.47 | IC1.6 69.58,55.37 69.58,60.07 70.98,61.47 92.06,61.47 98.39,55.14 v98.39,46.21 | U$1.9 57.03,18.41 v57.01,18.44
KEYROW9  (via drill 0.35)
  Top 0.254: v99.18,45.71 99.18,45.35 98.05,44.22 98.05,20.85 94.98,17.78 58.53,17.78 | v43.8,17.4 44.18,17.78 58.53,17.78 | v58.02,17.76 58.05,17.78 58.53,17.78
  Bottom 0.254: IC1.5 67.52,54.12 69.17,55.77 69.17,60.24 70.81,61.87 92.23,61.87 99.04,55.06 99.04,45.85 v99.18,45.71 | v43.8,17.4 43.86,17.34 J2.10 | U$1.10 58.03,17.75 v58.02,17.76
LCD0  (via drill 0.35)
  Top 0.254: v57.41,58.82 110.71,58.82 111.87,57.66 114.66,57.66 J1.3
  Bottom 0.254: IC1.97 58.14,58.82 v57.41,58.82
LCD1  (via drill 0.35)
  Top 0.254: J1.4 112.56,56.39 110.57,58.39 59.95,58.39 v59.73,58.16
  Bottom 0.254: v59.73,58.16 59.73,57.94 IC1.98
LCD2  (via drill 0.35)
  Top 0.254: v60.87,57.73 61.12,57.98 109.52,57.98 112.38,55.12 114.66,55.12 J1.5
  Bottom 0.254: IC1.99 60.87,57.51 v60.87,57.73
LCD3  (via drill 0.35)
  Top 0.254: J1.6 113.01,53.85 109.29,57.57 62.24,57.57 v61.99,57.32
  Bottom 0.254: v61.99,57.32 61.99,57.1 IC1.100
LCD4  (via drill 0.35)
  Top 0.254: J1.7 115.55,51.31 114.28,52.58 112.63,52.58 108.04,57.17 71.48,57.17 v71.23,56.92
  Bottom 0.254: v71.23,56.92 71.23,54.9 IC1.9
LCD5  (via drill 0.35)
  Top 0.254: v71.89,55.88 72.77,56.76 107.87,56.76 112.46,52.17 112.53,52.17 J1.8
  Bottom 0.254: IC1.10 71.89,54.85 v71.89,55.88
LCD6  (via drill 0.35)
  Top 0.254: J1.9 114.79,49.91 113.97,49.91 113.9,49.99 112.68,49.99 106.31,56.36 78.08,56.36 v77.83,56.1
  Bottom 0.254: v77.83,56.1 74.28,52.55 71.71,52.55 IC1.13
LCD7  (via drill 0.35)
  Top 0.254: v78.71,55.7 78.96,55.95 106.15,55.95 112.51,49.58 112.58,49.58 J1.10
  Bottom 0.254: IC1.14 72.01,52.15 74.45,52.15 77.75,55.45 78.11,55.45 78.36,55.7 v78.71,55.7
LCD8  (via drill 0.35)
  Top 0.254: J1.11 114.79,47.37 113.97,47.37 113.9,47.45 112.81,47.45 104.72,55.54 79.84,55.54 v79.59,55.29
  Bottom 0.254: v79.59,55.29 79.24,55.29 78.98,55.04 77.92,55.04 74.62,51.74 72.31,51.74 IC1.15
LCD9  (via drill 0.35)
  Top 0.254: v78.19,54.38 78.44,54.63 79.86,54.63 80.37,55.14 104.49,55.14 J1.12
  Bottom 0.254: IC1.16 72.61,51.33 74.79,51.33 77.84,54.38 v78.19,54.38
LCD10
  Bottom 0.254: IC1.32 76.11,38.74 78.98,38.74 85.2,44.96 114.66,44.96 J1.13
LCD11
  Bottom 0.254: J1.14 112.5,43.69 111.64,44.55 85.37,44.55 79.14,38.33 75.81,38.33 IC1.33
LCD12
  Bottom 0.254: IC1.34 71.87,41.66 75.61,37.92 79.31,37.92 85.54,44.15 110.78,44.15 112.5,42.42 114.66,42.42 J1.15
LCD13
  Bottom 0.254: J1.16 112.53,42.01 112.34,42.01 110.61,43.74 85.7,43.74 79.48,37.52 75.21,37.52 IC1.35
LCD14
  Bottom 0.254: IC1.36 71.16,40.96 75,37.11 79.65,37.11 85.87,43.33 109.18,43.33 112.63,39.88 114.66,39.88 J1.17
LCD15
  Bottom 0.254: J1.18 112.53,39.47 112.46,39.47 109.01,42.93 86.04,42.93 79.82,36.7 74.84,36.7 73.31,38.23 73.08,38.23 IC1.37
LCD_CS  (via drill 0.35)
  Top 0.254: J1.23 114.72,32.21 112.49,32.21 105.5,39.2 105.5,49.74 100.91,54.32 80.7,54.32 79.7,53.32 77.75,53.32 77.12,53.95 61.05,53.95 60.35,54.65 55.27,54.65 52.82,52.2 v52.82,50.93
  Bottom 0.254: v52.82,50.93 52.82,50.71 IC1.78
LCD_D/C  (via drill 0.35)
  Top 0.254: v53.81,50.65 50.27,47.12 50.27,32.51 51.04,31.75 v95.36,31.75
  Bottom 0.254: IC1.79 53.81,50.43 v53.81,50.65 | v95.36,31.75 110.09,31.75 112.12,29.72 114.66,29.72 J1.25
LCD_RD  (via drill 0.35)
  Top 0.254: v94.09,32.41 93.86,32.41 93.61,32.16 51.2,32.16 50.68,32.68 50.68,36.2 v50.93,36.45
  Bottom 0.254: J1.26 112.76,28.45 109.86,31.34 95.88,31.34 95.63,31.09 95.09,31.09 94.7,31.48 94.7,31.79 v94.09,32.41 | v50.93,36.45 52.71,38.23 55.03,38.23 55.31,38.51 56.96,38.51 IC1.64
LCD_RESET  (via drill 0.35)
  Top 0.254: J1.21 114.66,34.8 110.47,34.8 105.9,39.37 105.9,49.9 101.08,54.73 80.53,54.73 79.53,53.72 77.92,53.72 77.29,54.36 61.6,54.36 v60.33,55.63
  Bottom 0.254: 61.88,53.69 IC1.95 60.33,55.22 v60.33,55.63
LCD_W/R  (via drill 0.35)
  Top 0.254: J1.24 112.58,31.8 112.32,31.8 105.09,39.03 105.09,49.57 100.74,53.92 80.87,53.92 79.89,52.94 | 79.89,52.94 79.87,52.91 | v54.79,41.6 68.55,41.6 79.89,52.94
  Bottom 0.254: IC1.65 56.73,38.99 55.23,38.99 54.79,39.43 v54.79,41.6
N$1
  Bottom 0.305: U6.2 23.52,42.81 24.13,43.41 26.96,43.41 C24.1
N$4
  Bottom 0.254: IC1.1 66.91,56.24 66.91,56.77 66.02,57.66 64.12,57.66 63.68,58.1 X2.P$1 63.61,59.76 C2.2
N$5
  Bottom 0.254: C1.2 66.15,59.76 X2.P$2 66.15,59.62 66.15,58.42 67.67,56.9 67.67,56.29 IC1.2
N$6
  Bottom 0.305: U6.3 15.89,44.08 C22.2
N$9
  Bottom 0.305: U6.1 16.69,41.54 C22.1
N$12
  Bottom 0.305: C23.1 13.79,46.96 11.97,46.96 11.57,46.56 11.57,46 12.22,45.35 U6.4
N$15
  Bottom 0.305: C23.2 17.18,47.27 17.83,46.62 U6.5
N$21
  Bottom 0.305: U6.6 17.48,47.89 C13.1
N$22  (via drill 0.35)
  Top 0.152: DE9FEMALE.P5 12.28,40.87 v12.43,41.02 12.43,42.29 13.57,43.43 13.57,47.12 11.59,49.09 DE9FEMALE.P2
  Bottom 0.152: v12.43,41.02 12.43,42.04 12.22,42.24 DE9FEMALE.P9
N$24
  Bottom 0.305: USB.A5 11.61,14.02 R2.1
N$25
  Bottom 0.305: USB.B5 11.6,17.02 R3.1
N$26
  Bottom 0.254: IC1.89 57.71,53.59 56.81,53.59 L3.P$1 54.37,55.72 52.18,57.91 C16.2 C15.1 51.76,61.37 C14.1
N$27
  Bottom 0.254: IC1.91 57.64,55.08 57.64,55.95 L3.P$2
RESET  (via drill 0.35)
  Top 0.254: v29.19,52.32 29.19,54.46 30.59,55.86 39.34,55.86 39.59,55.6 47.78,55.6 48.82,56.64 v49.39,56.64
  Bottom 0.254: IC1.88 57.64,52.96 55.86,52.96 52.18,56.64 v49.39,56.64 47.99,58.04 47.99,59.69 46.59,61.09 43.8,61.09 43.54,60.83 TAG-CONNECT.P$10 | X1.10 v29.19,52.32 29.92,51.6 SW2.1 SW2.3 36.65,51.6 37.45,50.8 R15.2
RXD  (via drill 0.35)
  Top 0.305: v12.25,46.28 9.66,46.28 DE9FEMALE.P3
  Bottom 0.305: v12.25,46.28 12.58,45.95 19.98,45.95 20.59,45.35 U6.13
SWCLK  (via drill 0.35)
  Top 0.254: v58.82,56.01 57.17,57.66 49.26,57.66 47.86,56.26 v39.86,56.26 28.43,56.26 v25.51,53.34
  Bottom 0.254: TAG-CONNECT.P$4 39.73,56.39 v39.86,56.26 | v58.82,56.01 58.91,55.91 58.91,55.23 IC1.93 | v25.51,53.34 25.38,53.47 X1.4
SWDIO  (via drill 0.35)
  Top 0.254: v59.73,56.31 57.87,58.17 57.68,58.17 57.68,58.16 49.13,58.16 47.99,57.02 v42.27,57.02 42.17,56.92 39.59,56.92 39.44,56.77 27.8,56.77 v24.11,53.09
  Bottom 0.254: v59.73,56.31 59.73,55.95 59.67,55.9 59.67,55.17 IC1.94 | v42.27,57.02 TAG-CONNECT.P$2 | X1.2 v24.11,53.09
TXD  (via drill 0.35)
  Top 0.305: v12.14,43.55 9.65,43.55 DE9FEMALE.P4
  Bottom 0.305: U6.14 20.59,44.08 19.98,44.68 13.4,44.68 12.2,43.49 v12.14,43.55
UART_RX  (via drill 0.35)
  Top 0.254: v83.21,43.9 84.48,43.9 85.2,43.18 85.2,41.91 83.93,40.64 54.81,40.64 v52.23,43.23 | v27.92,46.61 29.08,47.77 v32.37,47.77
  Bottom 0.254: IC1.27 75.27,43.11 82.42,43.11 v83.21,43.9 | v52.23,43.23 47.68,47.77 v32.37,47.77 | U6.12 v27.92,46.62 v27.92,46.61
UART_TX  (via drill 0.35)
  Top 0.254: v82.53,44.58 83.19,45.23 84.25,45.23 85.98,43.5 85.98,41.59 84.25,39.86 54.4,39.86 51.67,42.58 v51.58,42.58
  Bottom 0.254: IC1.26 75.47,43.61 81.57,43.61 v82.53,44.58 | v51.58,42.58 47.18,46.99 29.19,46.99 28.3,47.89 U6.11
USB_N
  Bottom 0.254: USB.A7 4.4,15.52 arc-90 3.92,16 arc90 3.41,16.51 3.03,16.51 arc90 2.52,16 2.52,14.61 arc90 2.9,14.22 4.3,14.22 arc90 4.43,14.35 arc-90 4.6,14.52 USB.B7 10.68,14.52 11.16,14.99 18.02,14.99 36.06,33.03 44.41,33.03 IC1.74
USB_P
  Bottom 0.254: IC1.75 44.2,33.53 35.85,33.53 17.82,15.49 10.9,15.49 | USB.B6 10.38,16.02 10.9,15.49 | USB.A6 10.43,15.02 10.9,15.49
VUSB  (via drill 0.35)
  Top 0.254: v5.95,21.08 8.75,21.08 arc-90 10.02,19.81 10.02,18.29 arc-90 v9.63,17.91 | v6.84,9.14 9.76,9.14 arc90 10.9,10.29 10.9,12.45 arc90 v10.27,13.08
  Top 0.406: v6.84,9.14 14.44,9.14 20.79,2.79 89.26,2.79 95.36,8.89 105.52,8.89 J4.3
  Bottom 0.254: 6.46,9.14 v6.84,9.14 6.46,9.14 | 6.46,9.14 5.83,9.14 arc-90 3.41,11.56 3.41,11.94 arc90 2.52,12.83 arc-90 1.38,13.97 1.38,14.99 1.38,16.51 arc-90 2.78,17.91 arc90 3.92,19.05 3.92,19.81 arc-90 5.19,21.08 v5.95,21.08 | v9.63,17.91 arc-90 9.45,17.72 USB.B4A9 | v10.27,13.08 arc-90 10.01,12.82 USB.A4B9 | J4.4 J4.3
  Bottom 0.406: J4.4 110.6,6.1 109.2,4.7 101.2,4.7 97.52,8.38 93.45,8.38 88.76,3.68 21.06,3.68 17.64,7.11 17.64,13.84 19.41,15.62 19.99,15.62 20.95,16.58 VREG.3

### Text on the board
bPlace: R0 | R1 | R2 | R3 | R4 | R5 | R6 | R7 | R8 | R9 | C6 | C5 | C4 | C3 | C2 | C1 | C0 | 3V3 | GND | VUSB | 5V In